# Altium schematic sheet Memory.SchDoc
size B
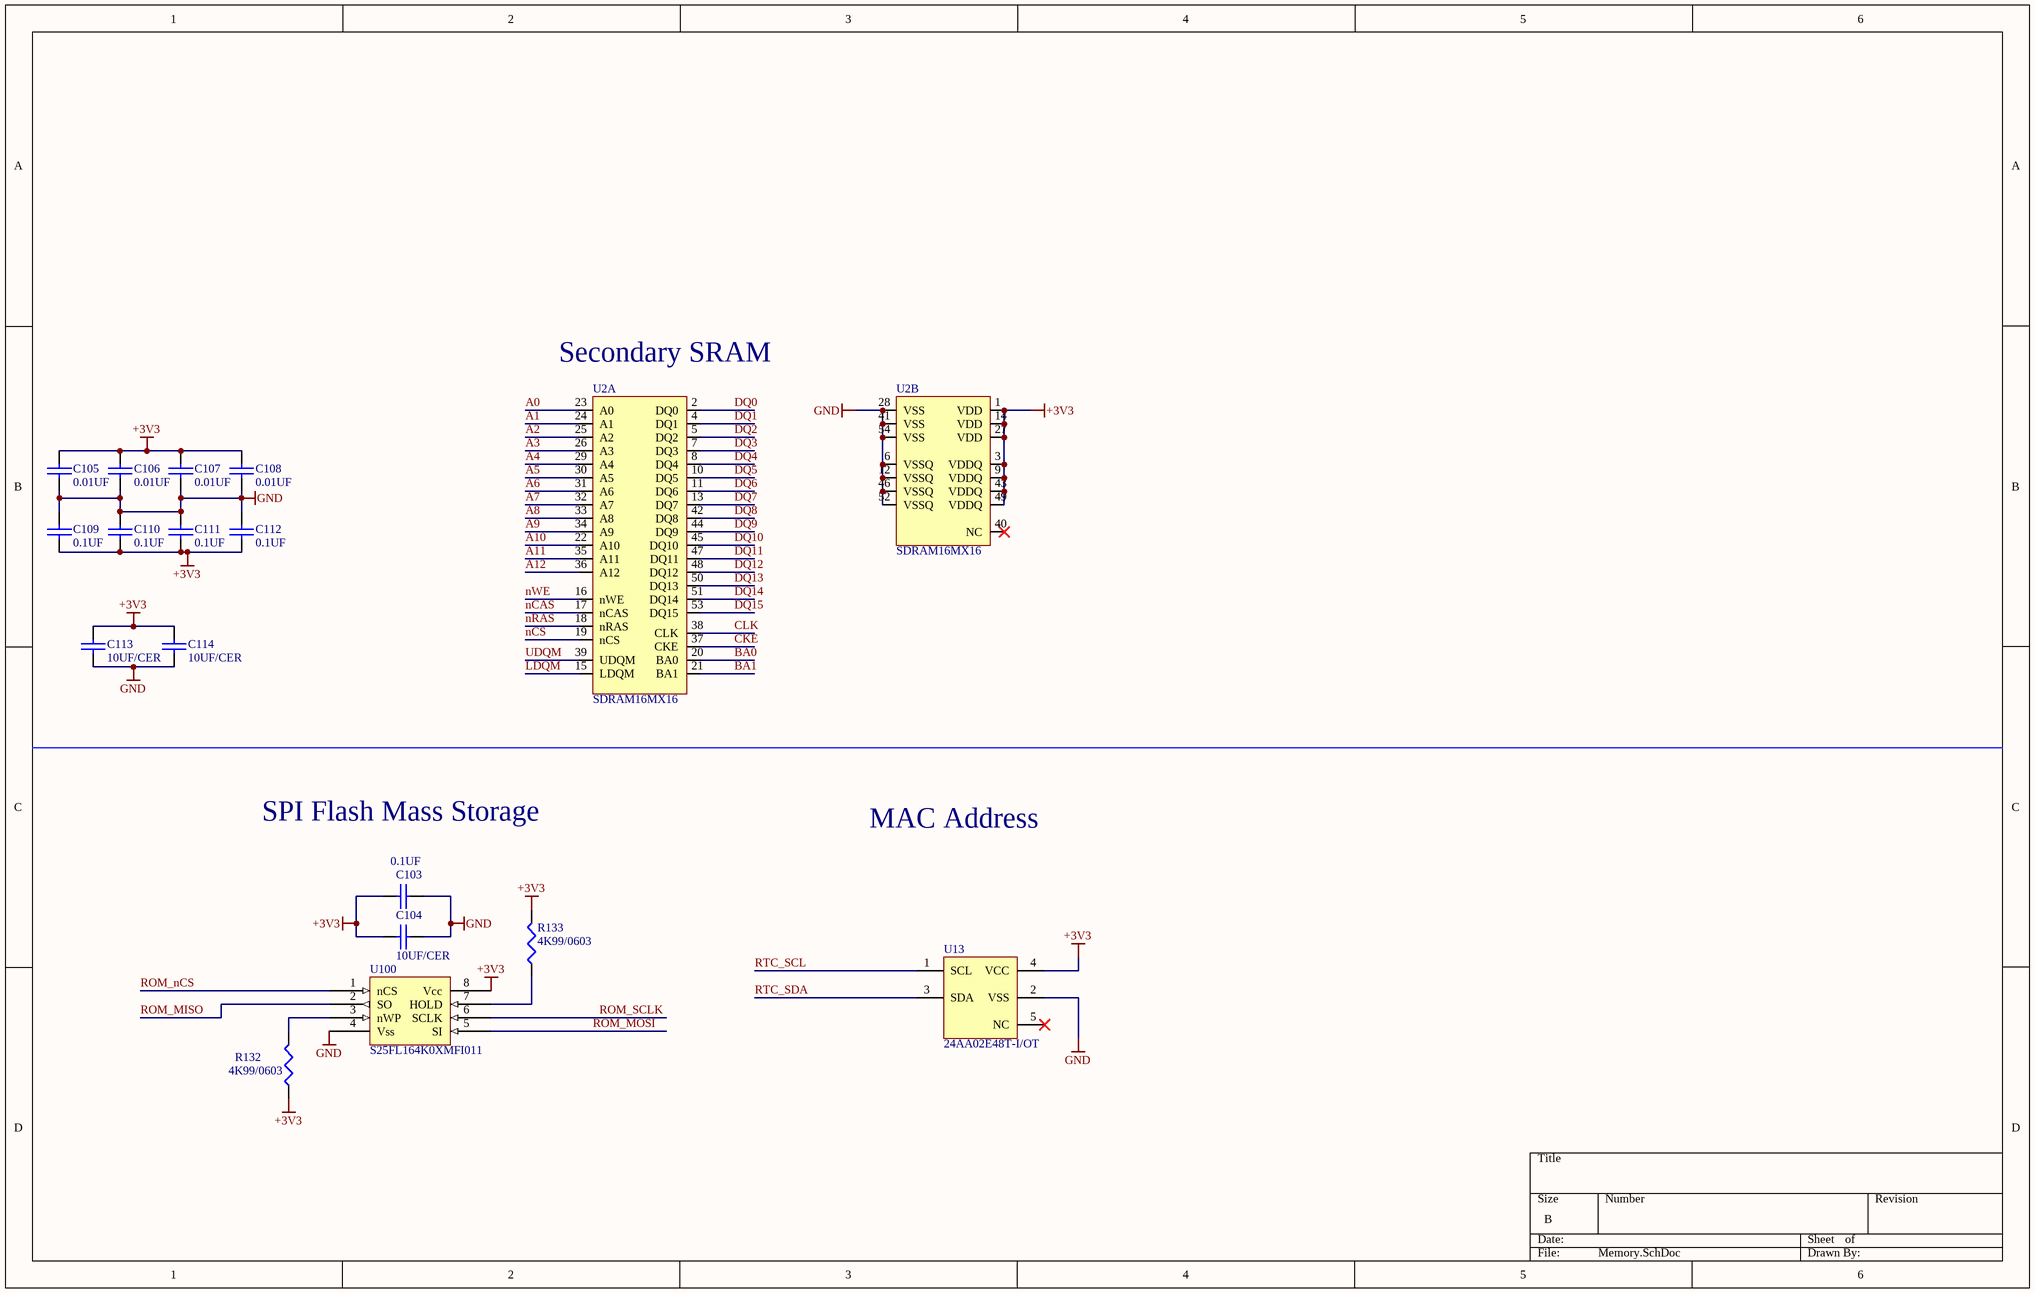
[diagram p0: Memory.SchDoc]

## Parts
C103  0.1UF  [0603]
C104  10UF/CER  [0805]
C105  0.01UF  [0603]
C106  0.01UF  [0603]
C107  0.01UF  [0603]
C108  0.01UF  [0603]
C109  0.1UF  [0603]
C110  0.1UF  [0603]
C111  0.1UF  [0603]
C112  0.1UF  [0603]
C113  10UF/CER  [0805]
C114  10UF/CER  [0805]
R132  4K99/0603  [0603]
R133  4K99/0603  [0603]
U2  SDRAM16MX16  [SOP54]  (parts A,B of 2)
U13  24AA02E48T-I/OT  [SOT23-5]
U100  S25FL164K0XMFI011  [SOC008]

## Nets
+3V3: C103.1 C104.1 C105.1 C106.1 C107.1 C108.1 C109.2 C110.2 C111.2 C112.2 C113.2 C114.2 R132.1 R133.2 U2.1(VDD) U2.3(VDDQ) U2.9(VDDQ) U2.14(VDD) U2.27(VDD) U2.43(VDDQ) U2.49(VDDQ) U13.4(VCC) U100.8(Vcc)
GND: C103.2 C104.2 C105.2 C106.2 C107.2 C108.2 C109.1 C110.1 C111.1 C112.1 C113.1 C114.1 U2.6(VSSQ) U2.12(VSSQ) U2.28(VSS) U2.41(VSS) U2.46(VSSQ) U2.52(VSSQ) U2.54(VSS) U13.2(VSS) U100.4(Vss)
A0: U2.23(A0)
A1: U2.24(A1)
A2: U2.25(A2)
A3: U2.26(A3)
A4: U2.29(A4)
A5: U2.30(A5)
A6: U2.31(A6)
A7: U2.32(A7)
A8: U2.33(A8)
A9: U2.34(A9)
A10: U2.22(A10)
A11: U2.35(A11)
A12: U2.36(A12)
BA0: U2.20(BA0)
BA1: U2.21(BA1)
CKE: U2.37(CKE)
CLK: U2.38(CLK)
DQ0: U2.2(DQ0)
DQ1: U2.4(DQ1)
DQ2: U2.5(DQ2)
DQ3: U2.7(DQ3)
DQ4: U2.8(DQ4)
DQ5: U2.10(DQ5)
DQ6: U2.11(DQ6)
DQ7: U2.13(DQ7)
DQ8: U2.42(DQ8)
DQ9: U2.44(DQ9)
DQ10: U2.45(DQ10)
DQ11: U2.47(DQ11)
DQ12: U2.48(DQ12)
DQ13: U2.50(DQ13)
DQ14: U2.51(DQ14)
DQ15: U2.53(DQ15)
LDQM: U2.15(LDQM)
nCAS: U2.17(nCAS)
nCS: U2.19(nCS)
nRAS: U2.18(nRAS)
nWE: U2.16(nWE)
ROM_MISO: U100.2(SO)
ROM_MOSI: U100.5(SI)
ROM_nCS: U100.1(nCS)
ROM_SCLK: U100.6(SCLK)
RTC_SCL: U13.1(SCL)
RTC_SDA: U13.3(SDA)
UDQM: U2.39(UDQM)
NetR132_2: R132.2 U100.3(nWP)
NetR133_1: R133.1 U100.7(HOLD)

Not connected (* = marked no-connect by the designer): U2 40(NC)*; U13 5(NC)*

## Notes on the sheet
- (near U2) Secondary SRAM
- SPI Flash Mass Storage
- MAC Address

## Library data of the parts
C103 C109-C112 = 0.1UF: CAP .10UF 16V CERAMIC X7R 0603; MFG: Kemet; MFG PN: C0603C104K4RACTU; DK PN: 399-1096-1-ND; Price: 1.17
C104 C113 C114 = 10UF/CER: 10µF ±10% 25V Ceramic Capacitor X7S 0805; Text Field1: Murata; Text Field2: GRM21BC71E106KE11L; Text Field3: 490-10496-1-ND
C105-C108 = 0.01UF: 10000pF ±10% 10V Ceramic Capacitor X7R 0603 (1608 Metric); MFG: Kemet; MFG PN: C0603C103K8RACTU; DK PN: 399-11132-1-ND; Price: 1.17
R132 R133 = 4K99/0603: RES 4.99K OHM 1/10W 1% 0603 SMD; MFG: Dale/Vishay; MFG PN: CRCW06034K99FKEAC; DK PN: 541-3985-1-ND; Price: 5.02
U2 = SDRAM16MX16: SDRAM Memory IC 256Mb (16M x 16) Parallel 166MHz 5ns 54-TSOP II; MFG: Winbond; MFG PN: W9825G6KH-6; DK PN: W9825G6KH-6-ND
U13 = 24AA02E48T-I/OT: IC EEPROM 2KBIT 400KHZ SOT23-5; MFG: Microchip; DK PN: 24AA02E48T-I/OTCT-ND; MFG PN: 24AA02E48T-I/OT
U100 = S25FL164K0XMFI011: IC FLASH 64MBIT 108MHZ 8SOIC; Text Field1: Cyoress; Text Field3: 1274-1097-ND; Text Field2: S25FL164K0XMFI011